# Altium schematic sheet Camera.SchDoc
size 431 x 279 mm; Organization: ORGANIZATION; Address1: ADDRESS 1; Address2: ADDRESS 2; Address3: ADDRESS 3; Address4: ADDRESS 4; Revision: -; SheetNumber: 4; SheetTotal: 8; ENG_APP_DATE: --/--/--; DSN_APP_DATE: --/--/--; CHK_APP_DATE: --/--/--
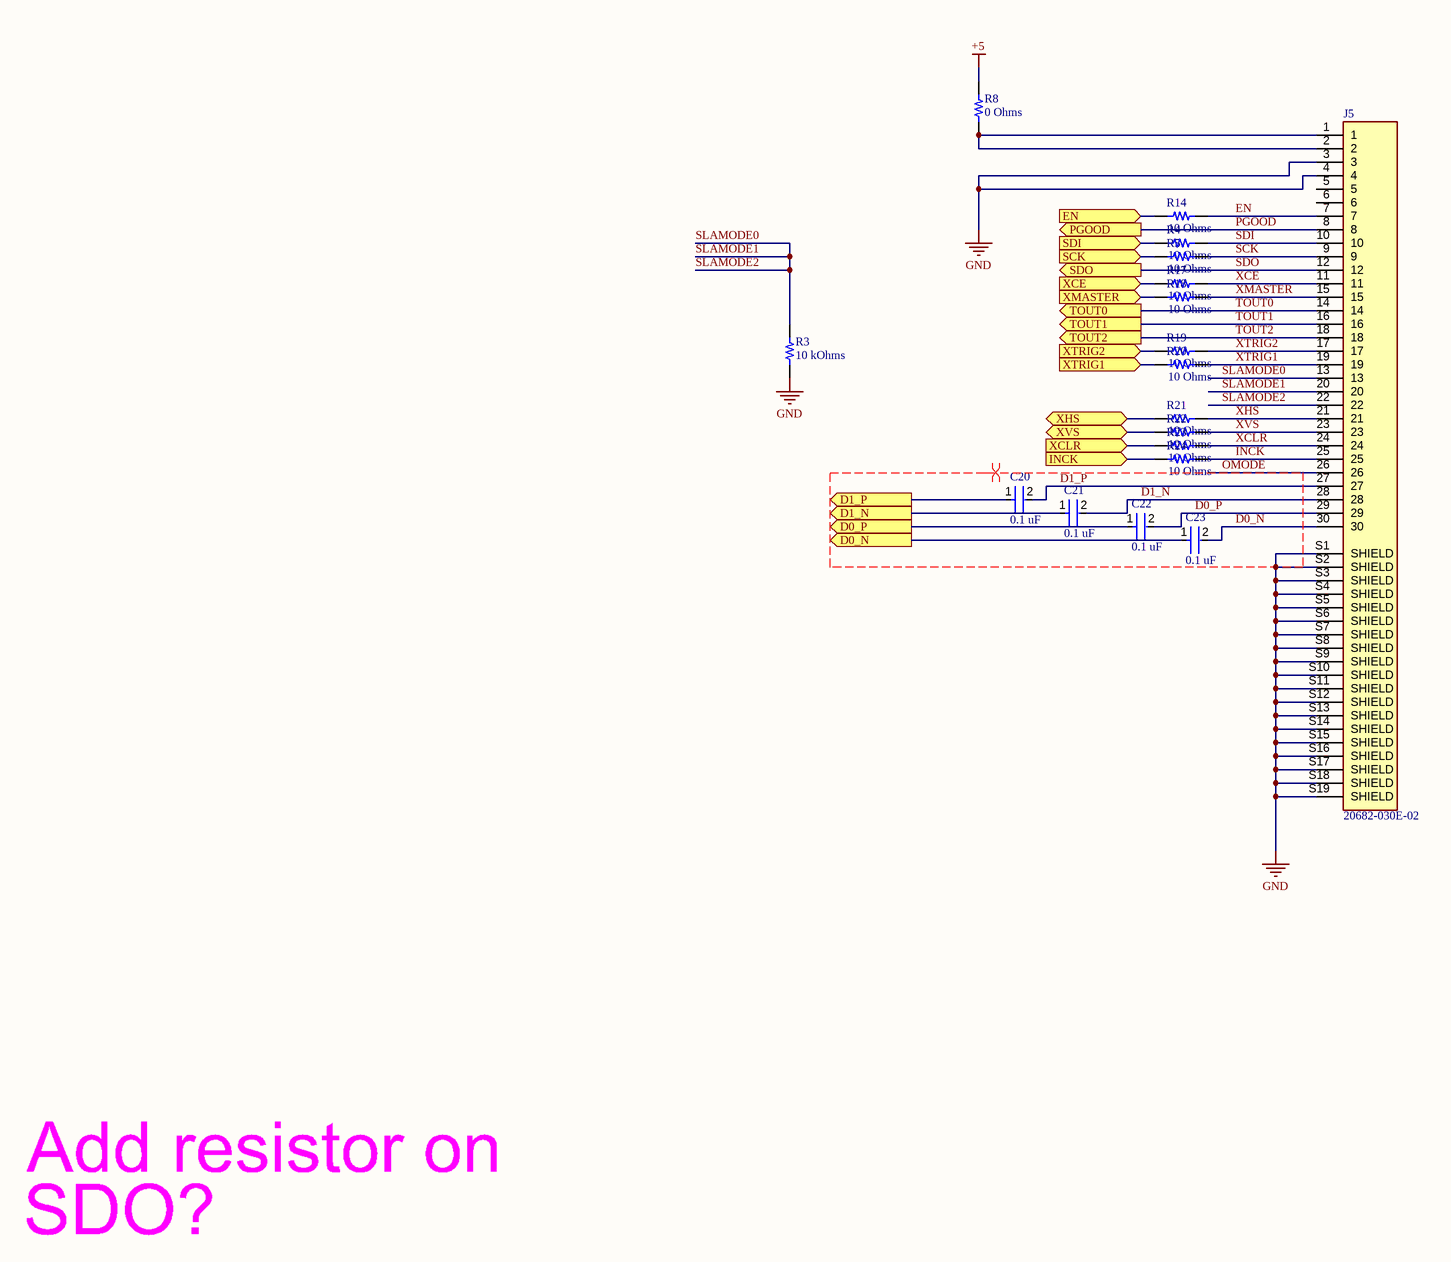
[diagram p0: Camera.SchDoc]

## Parts
C20  0.1 uF  [FP-GRM033-0_03-MFG]
C21  0.1 uF  [FP-GRM033-0_03-MFG]
C22  0.1 uF  [FP-GRM033-0_03-MFG]
C23  0.1 uF  [FP-GRM033-0_03-MFG]
J5  20682-030E-02  [IPEX_20682-030E-02]
R3  10 kOhms  [RES 0201_0603]
R4  10 Ohms  [RES 0201_0603]
R5  10 Ohms  [RES 0201_0603]
R8  0 Ohms  [RES 0402_1005]
R14  10 Ohms  [RES 0201_0603]
R17  10 Ohms  [RES 0201_0603]
R18  10 Ohms  [RES 0201_0603]
R19  10 Ohms  [RES 0201_0603]
R20  10 Ohms  [RES 0201_0603]
R21  10 Ohms  [RES 0201_0603]
R22  10 Ohms  [RES 0201_0603]
R23  10 Ohms  [RES 0201_0603]
R24  10 Ohms  [RES 0201_0603]

## Ports
D0_N (out), D0_P (out), D1_N (out), D1_P (out), EN (in), INCK (in), PGOOD (out), SCK (in), SDI (in), SDO (out), TOUT0 (out), TOUT1 (out), TOUT2 (out), XCE (in), XCLR (in), XHS (bidir), XMASTER (in), XTRIG1 (in), XTRIG2 (in), XVS (bidir)

## Nets
+5: R8.2
GND: J5.3 J5.4 J5.S1(SHIELD) J5.S2(SHIELD) J5.S3(SHIELD) J5.S4(SHIELD) J5.S5(SHIELD) J5.S6(SHIELD) J5.S7(SHIELD) J5.S8(SHIELD) J5.S9(SHIELD) J5.S10(SHIELD) J5.S11(SHIELD) J5.S12(SHIELD) J5.S13(SHIELD) J5.S14(SHIELD) J5.S15(SHIELD) J5.S16(SHIELD) J5.S17(SHIELD) J5.S18(SHIELD) J5.S19(SHIELD) R3.1
D0_N: C23.2 J5.30
D0_N: C23.1 ; port D0_N  [a separate net that carries the same name]
D0_P: C22.2 J5.29
D0_P: C22.1 ; port D0_P  [a separate net that carries the same name]
D1_N: C21.2 J5.28
D1_N: C21.1 ; port D1_N  [a separate net that carries the same name]
D1_P: C20.2 J5.27
D1_P: C20.1 ; port D1_P  [a separate net that carries the same name]
EN: J5.7 R14.2
EN: R14.1 ; port EN  [a separate net that carries the same name]
INCK: J5.25 R24.2
INCK: R24.1 ; port INCK  [a separate net that carries the same name]
OMODE: J5.26
PGOOD: J5.8 ; port PGOOD
SCK: J5.9 R5.2
SCK: R5.1 ; port SCK  [a separate net that carries the same name]
SDI: J5.10 R4.2
SDI: R4.1 ; port SDI  [a separate net that carries the same name]
SDO: J5.12 ; port SDO
SLAMODE0: J5.13 J5.20 J5.22 R3.2  [also labelled SLAMODE1, SLAMODE2]
TOUT0: J5.14 ; port TOUT0
TOUT1: J5.16 ; port TOUT1
TOUT2: J5.18 ; port TOUT2
XCE: J5.11 R17.2
XCE: R17.1 ; port XCE  [a separate net that carries the same name]
XCLR: J5.24 R23.2
XCLR: R23.1 ; port XCLR  [a separate net that carries the same name]
XHS: J5.21 R21.2
XHS: R21.1 ; port XHS  [a separate net that carries the same name]
XMASTER: J5.15 R18.2
XMASTER: R18.1 ; port XMASTER  [a separate net that carries the same name]
XTRIG1: J5.19 R20.2
XTRIG1: R20.1 ; port XTRIG1  [a separate net that carries the same name]
XTRIG2: J5.17 R19.2
XTRIG2: R19.1 ; port XTRIG2  [a separate net that carries the same name]
XVS: J5.23 R22.2
XVS: R22.1 ; port XVS  [a separate net that carries the same name]
NetJ5_1: J5.1 J5.2 R8.1

Not connected (* = marked no-connect by the designer): J5 5 6

## Layout directives
differential pair; net class SLVS-EC; differential pair class SLVS-EC: D0_N, D0_P, D1_N, D1_P, OMODE

## Notes on the sheet
- DWG. NO.
- REV.
- SHT.
- REVISION
- DESCRIPTION
- DATE
- APPROVED
- ENG:
- APPROVALS
- PROJECT
- DSN:
- CHK:
- REFERENCE DOCUMENTS
- PROJECT REVISION:
- TITLE
- SimulaVR
- DOCUMENT REVISION:
- DESIGN ITEM:
- BOM:
- FAB DWG:
- PCB DWG:
- ASSY DWG:
- SCALE:
- SIZE
- B
- CAGE CODE
- FILE NAME
- DWG NO.
- SHEET
- OF
- REV

## Library data of the parts
C20-C23 = CMP-001-00083-1: GRM033R61E104KE14D CAP CER 0.1UF 10V X5R 0201
J5 = CMP-004-000000-1: Cabline-CAII Rece. Ass'y; MF: {'manufacturer': u'I-PEX'}; Availability: Unavailable; Price: None; MP: 20682-030E-02; Design Item ID: 20682-030E-02; Source: 20682-030E-02.SchLib; Package: None; Value: *
R3 = ERJ-U01J103C: RES 10K OHM 5% 1/20W 0201 SMD; Manufacturer: Panasonic Electronic Components; Power (Watts): 0.05W, 1/20W; Temperature Coefficient: ±200ppm/°C; Part Number: ERJ-U01J103C; Value: 10 kOhms; ComponentLink1Description: Datasheet; ComponentLink1URL: https://industrial.panasonic.com/cdbs/www-data/pdf/RDP0000/AOA0000C334.pdf; ComponentLink2Description: DigiKey Link; ComponentLink2URL: https://www.digikey.com/en/products/detail/panasonic-electronic-components/ERJ-U01J103C/11635419; Composition: Thick Film; Device Package: 0201 (0603 Metric); Features: Anti-Sulfur; Height - Seated (Max): 0.010" (0.26mm); LastUpdated: 5/23/2022 1:02:10 PM; Lifecycle Status: Active; Minimum Order: 1; Number of Terminations: 2; Operating Temperature: -55°C ~ 125°C; Package / Case: 0201 (0603 Metric); Packaging: TapeAndReel; PartId: 57694; Part Status: Active; Price: 0.03; Resistance: 10 kOhms; Series: ERJ-U01; Size / Dimension: 0.024" L x 0.012" W (0.60mm x 0.30mm); Supplier 1: DigiKey; Supplier Part Number 1: 10-ERJ-U01J103CCT-ND; Supplier Device Package: 0201; Tolerance: ±5%
R4 R5 R14 R17-R24 = CRG0201F10R: RES SMD 10 OHM 1% 1/20W 0201; Manufacturer: TE Connectivity Passive Product; Power (Watts): 0.05W, 1/20W; Temperature Coefficient: ±400ppm/°C; Part Number: CRG0201F10R; Value: 10 Ohms; ComponentLink1Description: Datasheet; ComponentLink1URL: https://www.te.com/commerce/DocumentDelivery/DDEController?Action=srchrtrv&DocNm=1773204&DocType=DS&DocLang=English; ComponentLink2Description: DigiKey Link; ComponentLink2URL: https://www.digikey.com/en/products/detail/te-connectivity-passive-product/CRG0201F10R/4489648; Composition: Thick Film; Device Package: 0201 (0603 Metric); Height - Seated (Max): 0.010" (0.26mm); LastUpdated: 8/11/2022 9:03:27 AM; Lifecycle Status: Active; Minimum Order: 1; Number of Terminations: 2; Operating Temperature: -55°C ~ 155°C; Package / Case: 0201 (0603 Metric); Packaging: TapeAndReel; PartId: 3; Part Status: Active; Price: 0.03; Resistance: 10 Ohms; Series: CRG, Neohm; Size / Dimension: 0.024" L x 0.012" W (0.60mm x 0.30mm); Supplier 1: DigiKey; Supplier Part Number 1: A129573CT-ND; Supplier Device Package: 0201; Tolerance: ±1%
R8 = CRCW04020000Z0EDHP: RES SMD 0 OHM JUMPER 1/5W 0402; Manufacturer: Vishay Dale; Power (Watts): 0.2W, 1/5W; Part Number: CRCW04020000Z0EDHP; Value: 0 Ohms; ComponentLink1Description: Datasheet; ComponentLink1URL: http://www.vishay.com/docs/20043/crcwhpe3.pdf; ComponentLink2Description: DigiKey Link; ComponentLink2URL: https://www.digikey.com/en/products/detail/vishay-dale/CRCW04020000Z0EDHP/2222496; Composition: Thick Film; Device Package: 0402 (1005 Metric); Features: Automotive AEC-Q200, Pulse Withstanding; Height - Seated (Max): 0.016" (0.40mm); LastUpdated: 01.09.2022 12:46:55; Lifecycle Status: Active; Minimum Order: 1; Number of Terminations: 2; Operating Temperature: -55°C ~ 155°C; Package / Case: 0402 (1005 Metric); Packaging: TapeAndReel; PartId: 3131; Part Status: Active; Price: 0.01; Ratings: AEC-Q200; Resistance: 0 Ohms; Series: CRCW-HP; Size / Dimension: 0.039" L x 0.020" W (1.00mm x 0.50mm); Supplier 1: DigiKey; Supplier Part Number 1: 541-0.0YBCT-ND; Supplier Device Package: 0402; Tolerance: Jumper